# EAGLE design Adapter-Stamps-002 (EAGLE 7.3.0)
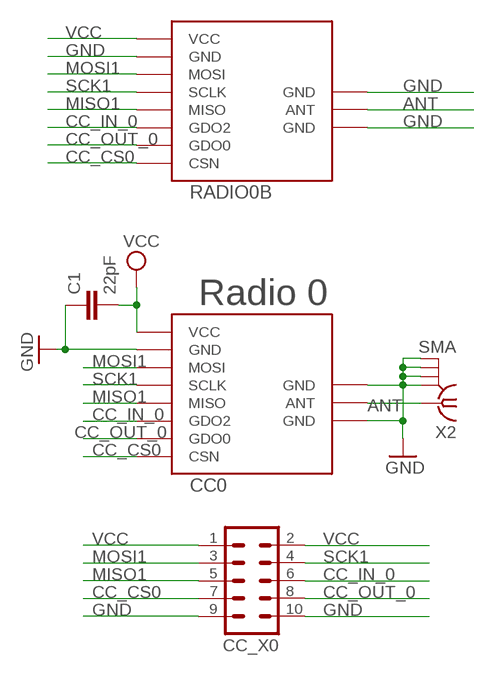
[diagram p0: schematic, sheet 1]

## Parts
C1  22pF  C-EUC0805  [C0805]
CC0  CC1101_MODULE1SMD  [CC1101_MODULE1_SMD]
CC_X0  MA05-2  [MA05-2]
RADIO0B  CC1101_MODULE1SMALL  [CC1101_MODULE1_SMD]
X2  SMA  [SMA]

## Nets
ANT: CC0.ANT RADIO0B.ANT X2.1
CC_CS0: CC0.CSN CC_X0.7 RADIO0B.CSN
CC_IN_0: CC0.GDO2 CC_X0.6 RADIO0B.GDO2
CC_OUT_0: CC0.GDO0 CC_X0.8 RADIO0B.GDO0
GND: C1.1 CC0.GND@0(GND) CC0.GND@1(GND) CC0.GND@2(GND) CC_X0.9 CC_X0.10 RADIO0B.GND@0(GND) RADIO0B.GND@1(GND) RADIO0B.GND@2(GND) X2.GND@1 X2.GND@2 X2.GND@3 X2.GND@4
MISO1: CC0.MISO CC_X0.5 RADIO0B.MISO
MOSI1: CC0.MOSI CC_X0.3 RADIO0B.MOSI
SCK1: CC0.SCLK CC_X0.4 RADIO0B.SCLK
VCC: C1.2 CC0.VCC CC_X0.1 CC_X0.2 RADIO0B.VCC

## Notes on the sheet
- Radio 0

## Library data of the parts
C1 = rcl:C-EU: CAPACITOR, European symbol
CC0 = wireless:CC1101_MODULE1: CC1101 wireless module for 433/868 MHz (sold from Aliexpress). DIL version for mounting with pin header (and SMD soldering) and SMD only variant available.
CC_X0 = con-lstb:MA05-2: PIN HEADER; OC_FARNELL: unknown; OC_NEWARK: unknown
RADIO0B = Martin-Communication:CC1101_MODULE1: CC1101 wireless module for 433/868 MHz (sold from Aliexpress). DIL version for mounting with pin header (and SMD soldering) and SMD only variant available.
X2 = sma:SMA: SMA 50 Ohm end launch jack receptacle - round contact

## Net classes
0 default: width 0.406 mm
1 PWR: width 0.305 mm

## Board
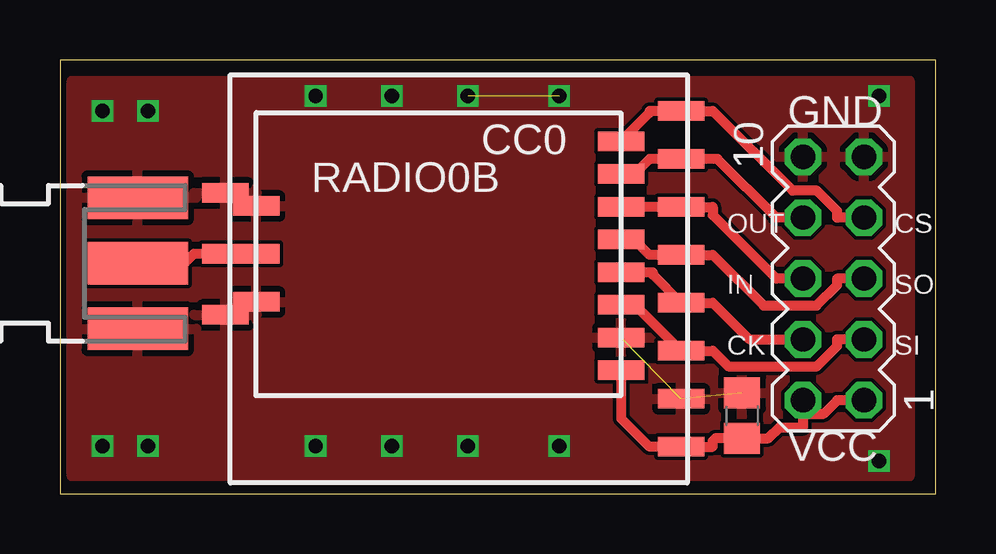
[diagram p1: board, top side]
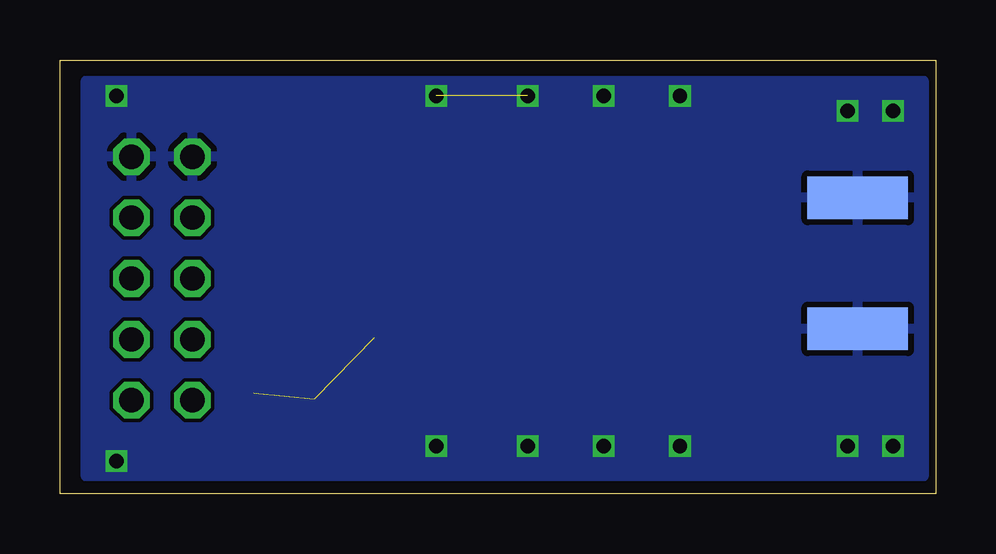
[diagram p2: board, bottom side, seen from below]

Size 36.5 x 18.09 mm. Coordinates in mm from the lower left corner, seen from the top.
Outline: 0,18.09 0,0 36.5,0 36.5,18.09 0,18.09
Copper layers (1*16): Top 0.035mm / dielectric 1.5mm / Bottom 0.035mm
Design rules "SeeedStudio_2layer_DRU_no_angle_20140221": minimum track width 6mil, minimum drill 12mil, track to track 6mil, track to pad 6mil, pad to pad 6mil, via to via 6mil, smd to smd 0mil, copper to edge 10mil, drill to drill 10mil, minimum pad ring 10mil, minimum via ring 6mil, stop-mask expansion 2mil, vias tented up to drill 100mil, thermal gap 10mil

### Footprints (pad centres in the part's own frame; a part is rotated, then mirrored left to right if it is on the bottom)
C0805 = smd 1.3 x 1.5: 1 -0.95,0; 2 0.95,0
CC1101_MODULE1_SMD = smd 1.93 x 0.813: ANT 19,5.96; CSN 0,0; GDO0 0,2; GDO2 0,4; GND@0 0,12; GND@1 19,8.5; GND@2 19,3.42; MISO 0,6; MOSI 0,10; SCLK 0,8; VCC 0,14
MA05-2 = drill 1.016 octagon: 1 -5.08,-1.27; 2 -5.08,1.27; 3 -2.54,-1.27; 4 -2.54,1.27; 5 0,-1.27; 6 0,1.27; 7 2.54,-1.27; 8 2.54,1.27; 9 5.08,-1.27; 10 5.08,1.27
CC1101_MODULE1_SMD' = smd 1.93 x 0.813: ANT 14.889,4.381; CSN -0.318,-0.318; GDO0 -0.318,1.048; GDO2 -0.318,2.413; GND@0 -0.318,7.872; GND@1 14.889,6.381; GND@2 14.889,2.381; MISO -0.318,3.777; MOSI -0.318,6.508; SCLK -0.318,5.143; VCC -0.318,9.238
SMA = smd 4.191 x 1.778: 1 2.115,0; GND@1 2.115,2.733; GND@2 2.115,-2.733 | smd 4.191 x 1.778 bottom: GND@3 2.115,2.733; GND@4 2.115,-2.733

### Placement (x,y rotation side)
C1  28.43,3.26 270 top
CC0  25.89,15.96 180 top
CC_X0  32.24,8.97 90 top
RADIO0B  CC1101_MODULE1SMALL  [CC1101_MODULE1_SMD']  23.08,14.39 180 top
X2  1.13,9.61 0 top

### Tracks (layer width: path | path; a pad name or v marks a point on that pad's centre or on a via)
ANT
  Top 0.406: RADIO0B.ANT CC0.ANT 5.57,10 5.18,9.61 X2.1
CC_CS0
  Top 0.406: RADIO0B.CSN 24.57,15.88 24.57,15.96 CC0.CSN 27.22,15.96 30.54,12.63 31.56,12.63 32.4,11.79 32.4,11.51 CC_X0.7
CC_IN_0
  Top 0.406: RADIO0B.GDO2 24.56,11.97 24.57,11.96 CC0.GDO2 27.22,11.96 27.22,11.62 29.86,8.97 CC_X0.6
CC_OUT_0
  Top 0.406: RADIO0B.GDO0 23.95,13.34 24.57,13.96 CC0.GDO0 27.41,13.96 29.86,11.51 CC_X0.8
GND  (via drill 0.6)  (3 unrouted)
  other vias: 1.77,15.96 3.67,15.96 1.77,1.99 3.67,1.99 10.65,1.99 13.83,1.99 17,1.99 20.81,1.99 10.65,16.59 13.83,16.59 17,16.59 20.81,16.59 34.15,1.35 34.15,16.59
  pour Bottom: 0.49,17.23 0.49,0.72 35.42,0.72 35.42,17.23
  pour Top: 0.49,0.72 0.49,17.23 35.42,17.23 35.42,0.72
MISO1
  Top 0.406: RADIO0B.MISO 23.93,10.61 24.57,9.96 CC0.MISO 27.22,9.96 29.33,7.84 31.54,7.84 32.4,8.7 32.4,8.97 CC_X0.5
MOSI1
  Top 0.406: CC_X0.3 32.4,6.44 32.4,6.16 31.55,5.32 27.86,5.32 27.22,5.96 CC0.MOSI 23.98,7.88 RADIO0B.MOSI
SCK1
  Top 0.406: CC_X0.4 28.74,6.44 27.22,7.96 CC0.SCLK 24.71,9.14 24.71,9.24 RADIO0B.SCLK
VCC
  Top 0.406: RADIO0B.VCC 23.39,3.14 24.57,1.96 CC0.VCC 27.22,1.96 27.22,2.2 27.33,2.31 27.88,2.31 C1.2 29.54,2.31 30.01,2.78 30.97,2.78 30.97,3.34 | CC_X0.1 32.4,3.9 31.84,3.34 30.97,3.34 | CC_X0.2 30.97,3.34

### Text on the board
tNames: GND | OUT | CS | IN | SO | CK | SI | VCC